# EAGLE design PacBot Official Schematic (EAGLE 9.2.0)
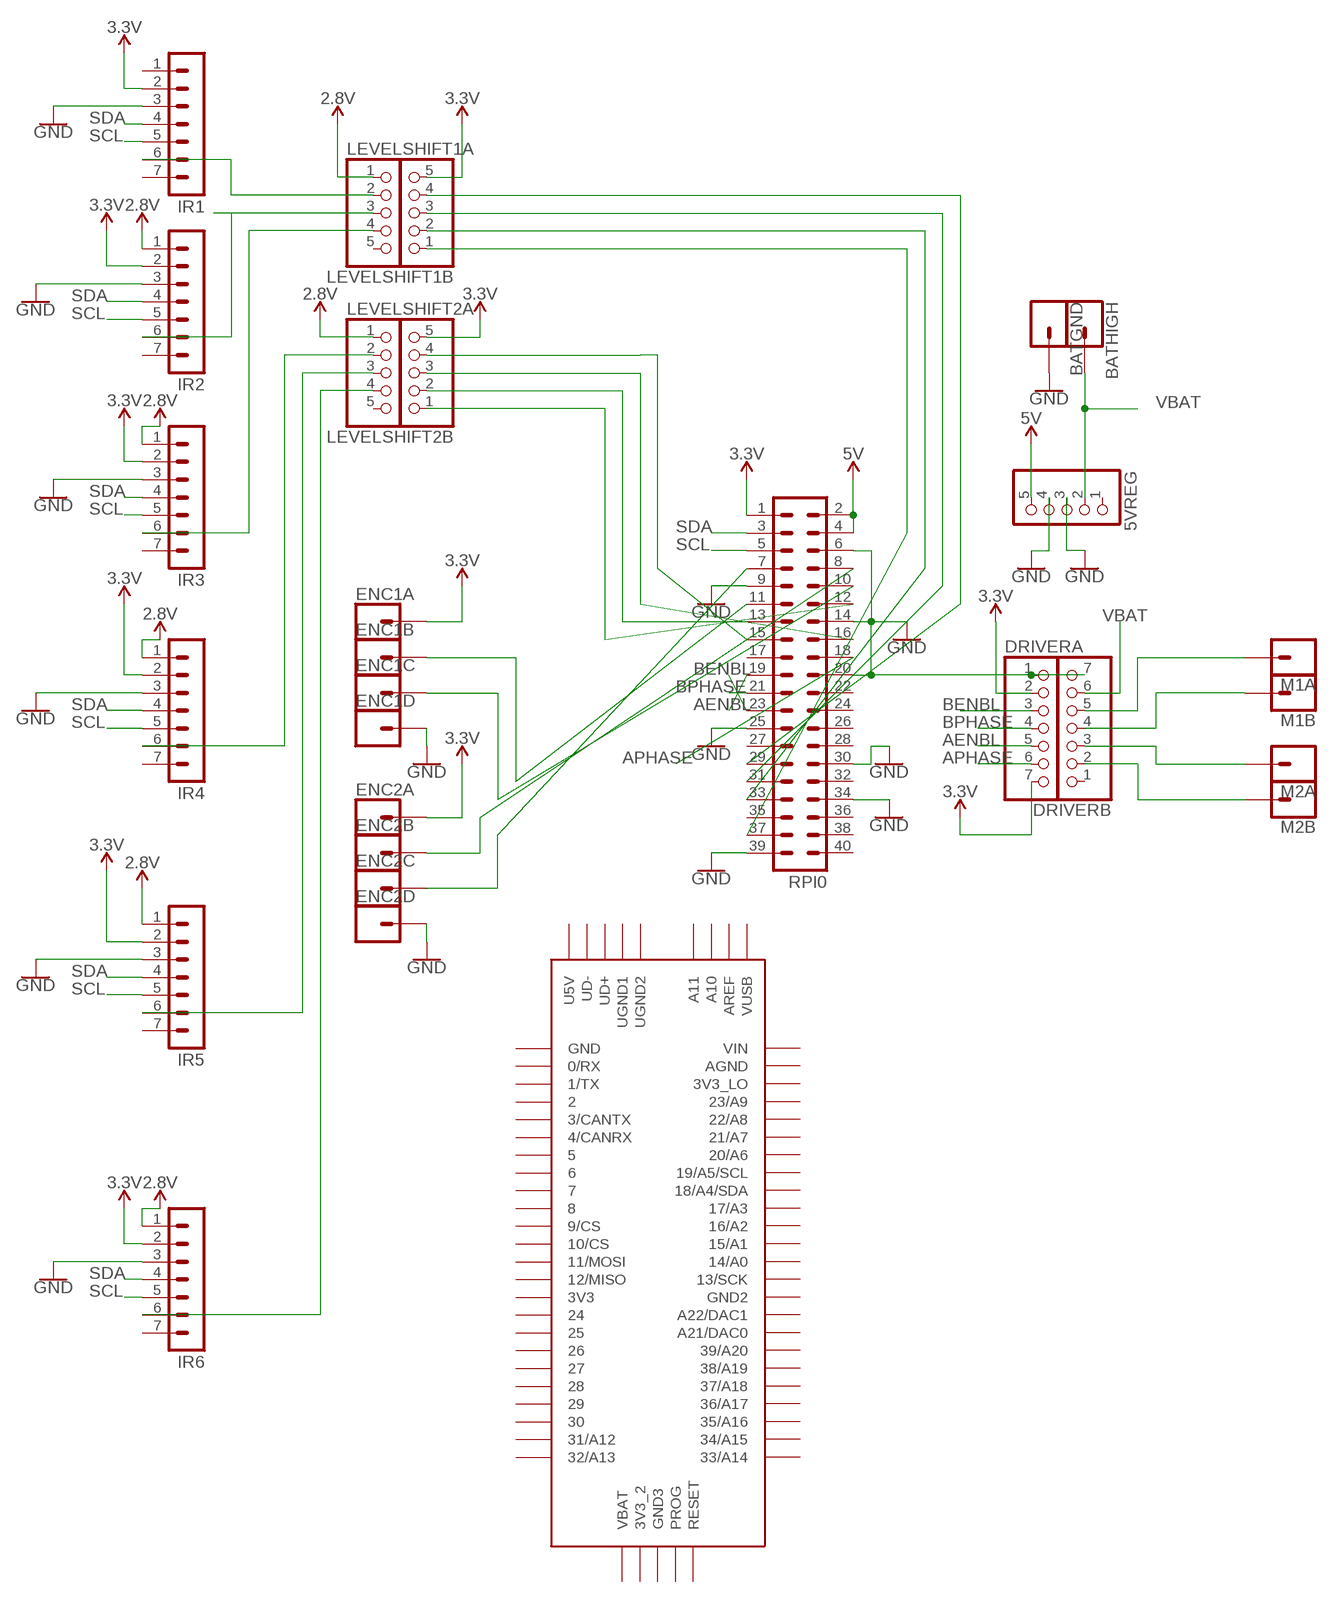
[diagram p0: schematic, sheet 1]

## Parts
5VREG  PINHD-1X5  [1X05]
BATGND  CONN_01  [1X01]
BATHIGH  CONN_01  [1X01]
DRIVERA  PINHD-1X7  [1X07]
DRIVERB  PINHD-1X7  [1X07]
ENC1A  CONN_01  [1X01]
ENC1B  CONN_01  [1X01]
ENC1C  CONN_01  [1X01]
ENC1D  CONN_01  [1X01]
ENC2A  CONN_01  [1X01]
ENC2B  CONN_01  [1X01]
ENC2C  CONN_01  [1X01]
ENC2D  CONN_01  [1X01]
IR1  MA07-1  [MA07-1]
IR2  MA07-1  [MA07-1]
IR3  MA07-1  [MA07-1]
IR4  MA07-1  [MA07-1]
IR5  MA07-1  [MA07-1]
IR6  MA07-1  [MA07-1]
LEVELSHIFT1A  PINHD-1X5  [1X05]
LEVELSHIFT1B  PINHD-1X5  [1X05]
LEVELSHIFT2A  PINHD-1X5  [1X05]
LEVELSHIFT2B  PINHD-1X5  [1X05]
M1A  CONN_01  [1X01]
M1B  CONN_01  [1X01]
M2A  CONN_01  [1X01]
M2B  CONN_01  [1X01]
RPI0  MA20-2  [MA20-2]
U$1  TEENSY_3.5/3.6  [TEENSY_3.5/3.6]

## Nets
2.8V: IR2.1 IR3.1 IR4.1 IR5.1 IR6.1 LEVELSHIFT1A.1 LEVELSHIFT2A.1
3.3V: DRIVERA.2 DRIVERA.7 ENC1A.1 ENC2A.1 IR1.2 IR2.2 IR3.2 IR4.2 IR5.2 IR6.2 LEVELSHIFT1B.5 LEVELSHIFT2B.5 RPI0.1
5V: 5VREG.5 RPI0.2 RPI0.4
AENBL: DRIVERA.5 RPI0.19
APHASE: DRIVERA.6 RPI0.18
BENBL: DRIVERA.3 RPI0.23
BPHASE: DRIVERA.4 RPI0.21
GND: 5VREG.3 5VREG.4 BATGND.1 DRIVERA.1 DRIVERB.7 ENC1D.1 ENC2D.1 IR1.3 IR2.3 IR3.3 IR4.3 IR5.3 IR6.3 RPI0.6 RPI0.9 RPI0.14 RPI0.20 RPI0.25 RPI0.30 RPI0.34 RPI0.39
N$1: ENC1B.1 RPI0.11
N$2: LEVELSHIFT1A.3
N$3: IR4.6 LEVELSHIFT2A.2
N$4: IR2.6
N$6: LEVELSHIFT2B.2 RPI0.13
N$7: LEVELSHIFT2B.1 RPI0.12
N$8: DRIVERB.5 M1A.1
N$9: DRIVERB.4 M1B.1
N$10: DRIVERB.3 M2A.1
N$11: DRIVERB.2 M2B.1
N$12: ENC1C.1 RPI0.10
N$13: ENC2B.1 RPI0.8
N$14: ENC2C.1 RPI0.7
N$15: IR5.6 LEVELSHIFT2A.3
N$16: IR6.6 LEVELSHIFT2A.4
N$17: LEVELSHIFT1B.4 RPI0.29
N$18: LEVELSHIFT1B.3 RPI0.31
N$19: LEVELSHIFT1B.2 RPI0.33
N$20: LEVELSHIFT1B.1 RPI0.37
N$21: LEVELSHIFT2B.4 RPI0.15
N$22: LEVELSHIFT2B.3 RPI0.16
N$23: IR1.6 LEVELSHIFT1A.2
N$25: IR3.6 LEVELSHIFT1A.4
SCL: IR1.5 IR2.5 IR3.5 IR4.5 IR5.5 IR6.5 RPI0.5
SDA: IR1.4 IR2.4 IR3.4 IR4.4 IR5.4 IR6.4 RPI0.3
VBAT: 5VREG.2 BATHIGH.1 DRIVERB.6
Unconnected: 5VREG.1 DRIVERB.1 IR1.1 IR1.7 IR2.7 IR3.7 IR4.7 IR5.7 IR6.7 LEVELSHIFT1A.5 LEVELSHIFT2A.5 RPI0.17 RPI0.22 RPI0.24 RPI0.26 RPI0.27 RPI0.28 RPI0.32 RPI0.35 RPI0.36 RPI0.38 RPI0.40 U$1.0/RX U$1.1/TX U$1.2 U$1.3/CANTX U$1.3V3 U$1.3V3_2 U$1.3V3_LO U$1.4/CANRX U$1.5 U$1.6 U$1.7 U$1.8 U$1.9/CS U$1.10/CS U$1.11/MOSI U$1.12/MISO U$1.13/SCK U$1.14/A0 U$1.15/A1 U$1.16/A2 U$1.17/A3 U$1.18/A4/SDA U$1.19/A5/SCL U$1.20/A6 U$1.21/A7 U$1.21/DAC0(A21/DAC0) U$1.22/A8 U$1.23/A9 U$1.24 U$1.25 U$1.26 U$1.27 U$1.28 U$1.29 U$1.30 U$1.31/A12 U$1.32/A13 U$1.33/A14 U$1.34/A15 U$1.35/A16 U$1.36/A17 U$1.37/A18 U$1.38/A19 U$1.39/A20 U$1.A10 U$1.A11 U$1.A22/DAC1 U$1.AGND U$1.AREF U$1.GND U$1.GND2 U$1.GND3 U$1.PROG U$1.RESET U$1.U5V U$1.UD+ U$1.UD- U$1.UGND1 U$1.UGND2 U$1.VBAT U$1.VIN U$1.VUSB

## Library data of the parts
5VREG LEVELSHIFT1A LEVELSHIFT1B LEVELSHIFT2A LEVELSHIFT2B = pinhead:PINHD-1X5: PIN HEADER
BATGND BATHIGH ENC1A ENC1B ENC1C ENC1D ENC2A ENC2B ENC2C ENC2D M1A M1B M2A M2B = SparkFun-Connectors:CONN_01: Single connection point. Often used as Generic Header-pin footprint for 0.1 inch spaced/style header connections On any of the 0.1 inch spaced packages, you can populate with these: Break Away Headers - Straight <https://www.sparkfun.com/products/116> (PRT-00116) Break Away Male Headers - Right Angle <https://www.sparkfun.com/products/553> (PRT-00553) Female Headers <https://www.sparkfun.com/products/115> (PRT-00115) Break Away Headers - Machine Pin <https://www.sparkfun.com/products/117> (PRT-00117) Break Away Female Headers - Swiss Machine Pin <https://www.sparkfun.com/products/743> (PRT-00743) This device is also useful as a general connection point to wire up your design to another part of your project. Our various solder wires solder well into these plated through hole pads. Hook-Up Wire - Assortment (Stranded, 22 AWG) <https://www.sparkfun.com/products/11375> (PRT-11375) Hook-Up Wire - Assortment (Solid Core, 22 AWG) <https://www.sparkfun.com/products/11367> (PRT-11367) View the entire wire category on our website here <https://www.sparkfun.com/categories/141> Special notes: SMTSO-256-ET is a "flush mount" nut for a 4-40 screw. We mostly use this on specialty testbeds; it is a nice way to connect hardware to your PCB at an adjustable hieght. Also note, the SNAP packages are for using a snappable style connector. We sell a baggie of snaps and they are also used on two LilyPad designs: Snap Assortment - 30 pack (male and female) <https://www.sparkfun.com/products/11347> (DEV-11347) LilyPad Arduino SimpleSnap <https://www.sparkfun.com/products/10941> (DEV-10941) LilyPad SimpleSnap Protoboard <https://www.sparkfun.com/products/10940> (DEV-10940)
DRIVERA DRIVERB = pinhead:PINHD-1X7: PIN HEADER
IR1-IR6 = con-lstb:MA07-1: PIN HEADER; OC_FARNELL: unknown; OC_NEWARK: unknown
RPI0 = con-lstb:MA20-2: PIN HEADER; OC_FARNELL: unknown; OC_NEWARK: unknown
U$1 = Teensy356:TEENSY_3.5/3.6

## Board
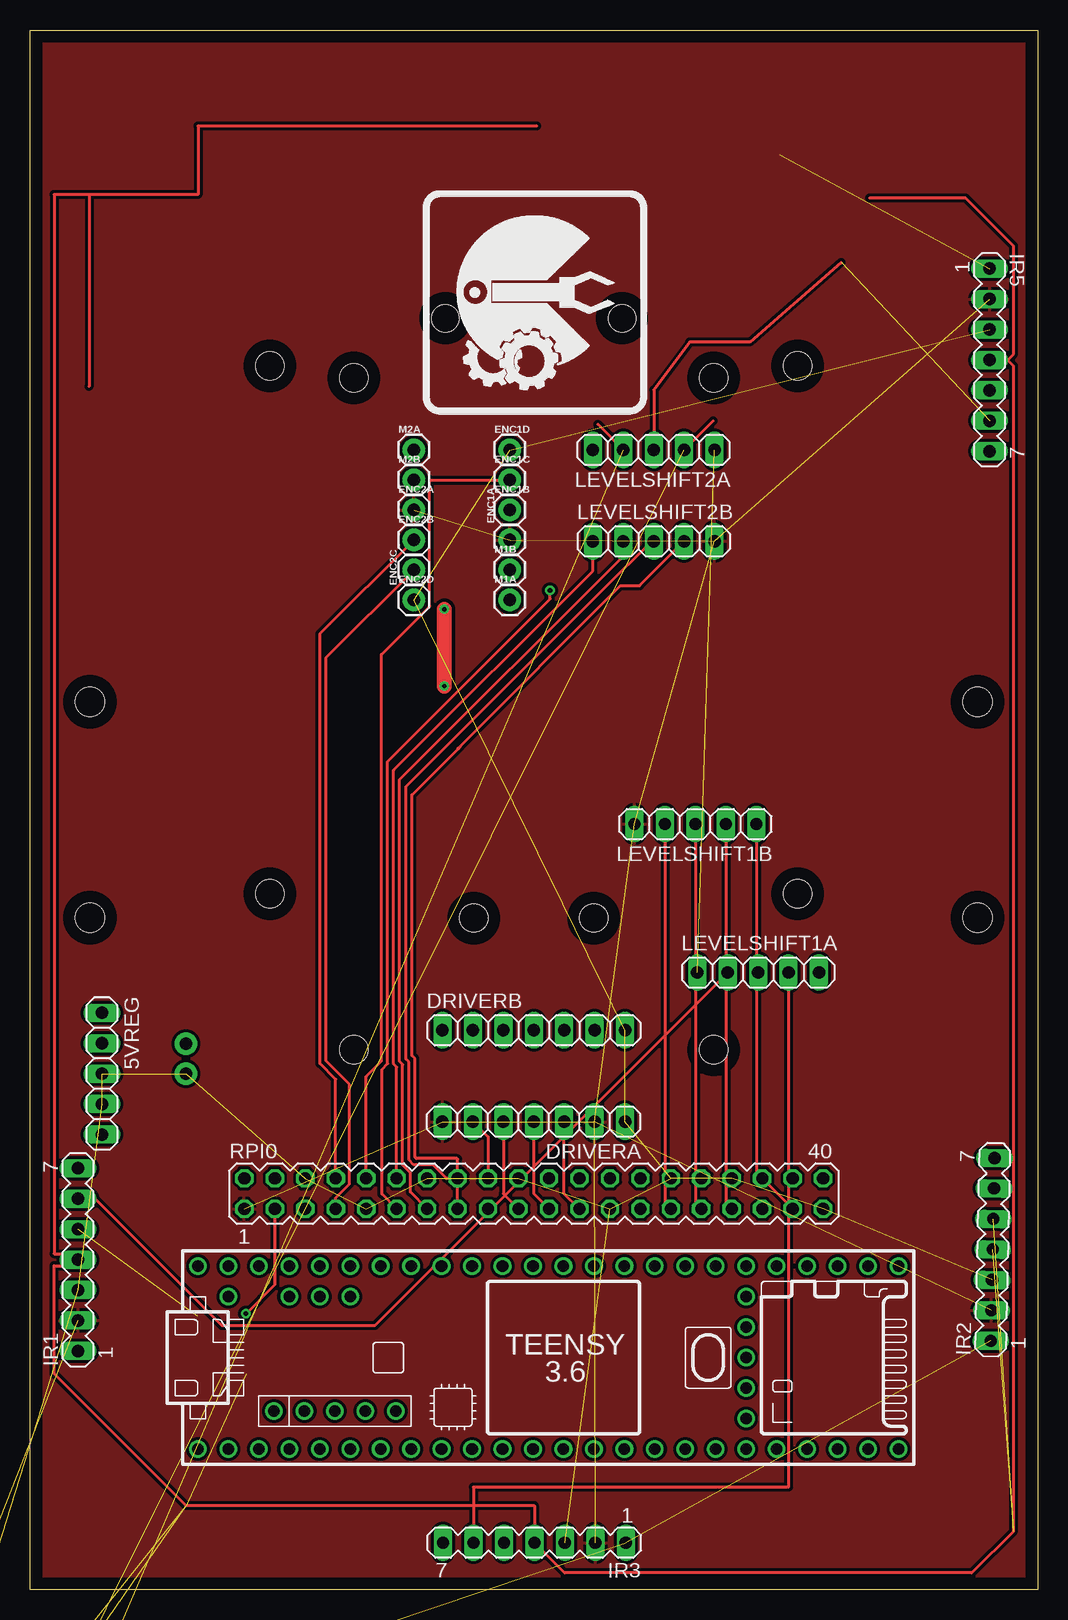
[diagram p1: board, top side]
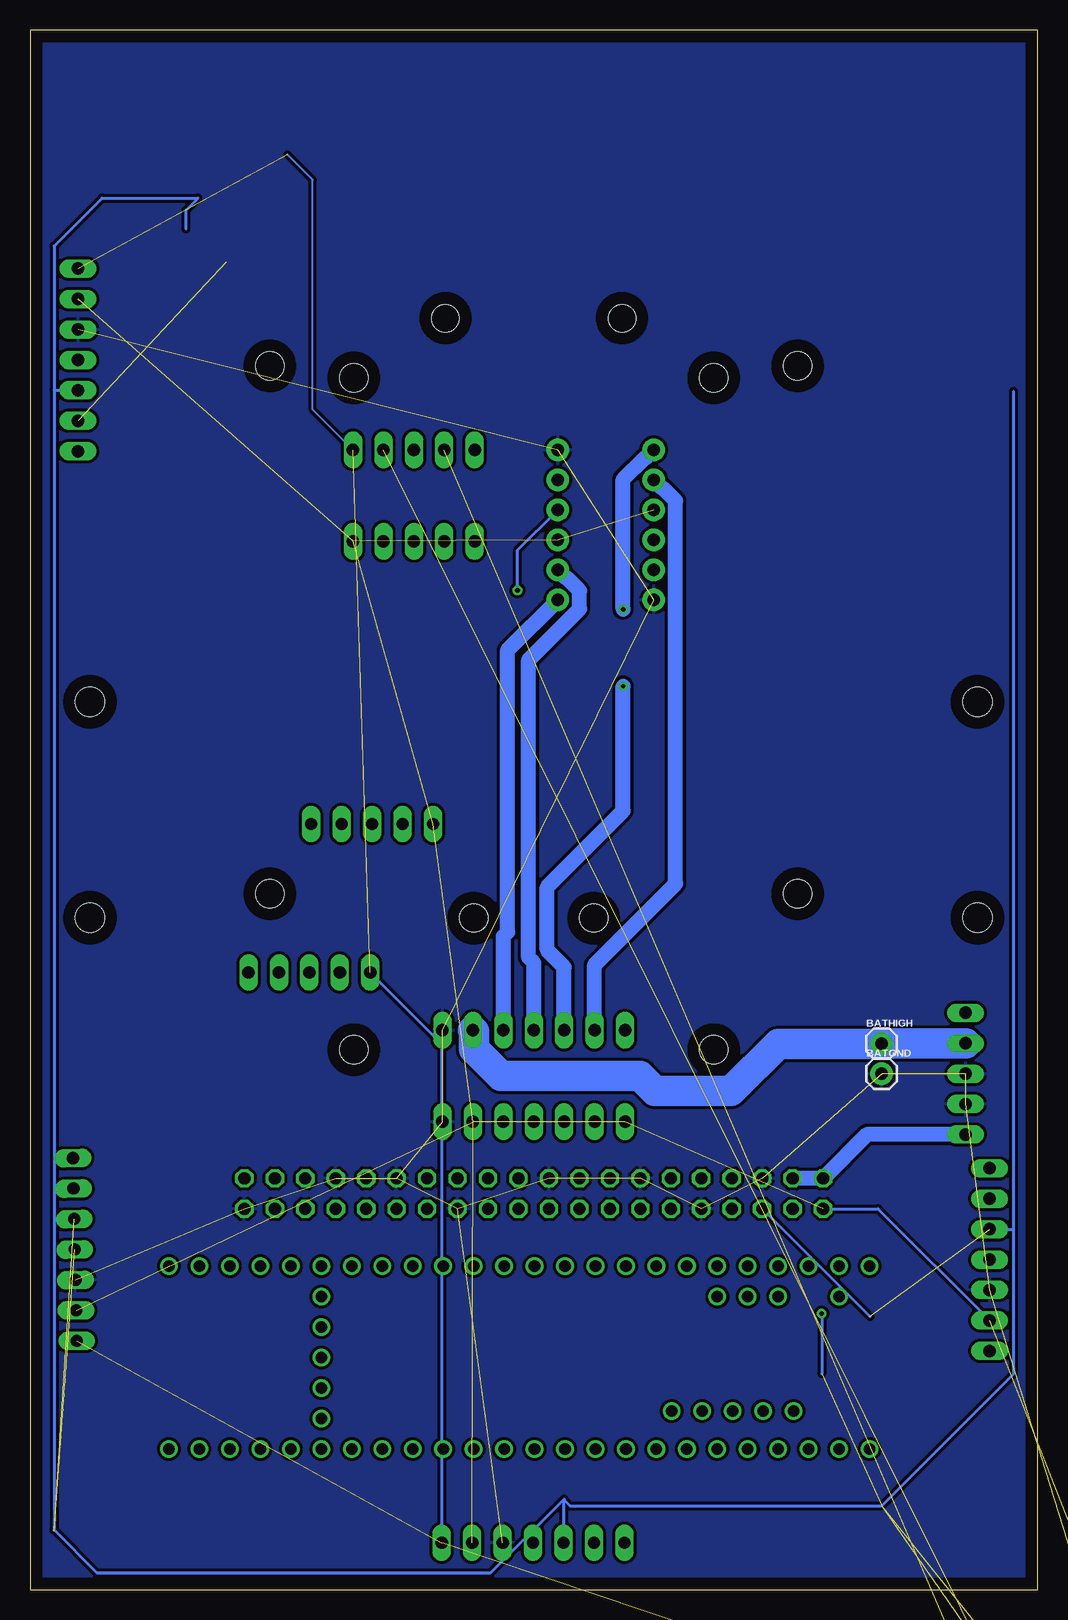
[diagram p2: board, bottom side, seen from below]

Size 84 x 130 mm. Coordinates in mm from the lower left corner, seen from the top.
Outline: 84,0 0,0 0,130 84,130 84,0
Copper layers (1*16): Top 0.035mm / dielectric 1.5mm / Bottom 0.035mm
Design rules "Pacbot v1 *": minimum track width 10mil, minimum drill 0.35mm, track to track 10mil, track to pad 10mil, pad to pad 10mil, via to via 10mil, smd to smd 10mil, copper to edge 40mil, drill to drill 10mil, minimum pad ring 10mil, minimum via ring 8mil, stop-mask expansion 4mil, vias tented up to drill 0mil, thermal gap 10mil
Holes 2.33 mm at 57,45 64,58 47,55.97 37,55.97 20,58 27,45 57,101 64,102 27,101 20,102
Holes 2.44 mm at 79,56 79,74 5,56 5,74
Holes 2.29 mm at 49.37,105.97 34.63,105.97

### Footprints (pad centres in the part's own frame; a part is rotated, then mirrored left to right if it is on the bottom)
1X05 = drill 1.016 long: 1 -5.08,0; 2 -2.54,0; 3 0,0; 4 2.54,0; 5 5.08,0
1X01 = drill 1.016 pad 1.88: 1 0,0
1X07 = drill 1.016 long: 1 -7.62,0; 2 -5.08,0; 3 -2.54,0; 4 0,0; 5 2.54,0; 6 5.08,0; 7 7.62,0
MA07-1 = drill 1.016 long: 1 -7.62,0; 2 -5.08,0; 3 -2.54,0; 4 0,0; 5 2.54,0; 6 5.08,0; 7 7.62,0
MA20-2 = drill 1.016 octagon: 1 -24.13,-1.27; 2 -24.13,1.27; 3 -21.59,-1.27; 4 -21.59,1.27; 5 -19.05,-1.27; 6 -19.05,1.27; 7 -16.51,-1.27; 8 -16.51,1.27; 9 -13.97,-1.27; 10 -13.97,1.27; 11 -11.43,-1.27; 12 -11.43,1.27; 13 -8.89,-1.27; 14 -8.89,1.27; 15 -6.35,-1.27; 16 -6.35,1.27; 17 -3.81,-1.27; 18 -3.81,1.27; 19 -1.27,-1.27; 20 -1.27,1.27; 21 1.27,-1.27; 22 1.27,1.27; 23 3.81,-1.27; 24 3.81,1.27; 25 6.35,-1.27; 26 6.35,1.27; 27 8.89,-1.27; 28 8.89,1.27; 29 11.43,-1.27; 30 11.43,1.27; 31 13.97,-1.27; 32 13.97,1.27; 33 16.51,-1.27; 34 16.51,1.27; 35 19.05,-1.27; 36 19.05,1.27; 37 21.59,-1.27; 38 21.59,1.27; 39 24.13,-1.27; 40 24.13,1.27
TEENSY_3.5/3.6 = drill 0.965: 0/RX -25.4,-7.62; 1/TX -22.86,-7.62; 2 -20.32,-7.62; 3/CANTX -17.78,-7.62; 3V3 7.62,-7.62; 3V3_2 17.78,-2.54; 3V3_LO -22.86,7.62; 4/CANRX -15.24,-7.62; 5 -12.7,-7.62; 6 -10.16,-7.62; 7 -7.62,-7.62; 8 -5.08,-7.62; 9/CS -2.54,-7.62; 10/CS 0,-7.62; 11/MOSI 2.54,-7.62; 12/MISO 5.08,-7.62; 13/SCK 5.08,7.62; 14/A0 2.54,7.62; 15/A1 0,7.62; 16/A2 -2.54,7.62; 17/A3 -5.08,7.62; 18/A4/SDA -7.62,7.62; 19/A5/SCL -10.16,7.62; 20/A6 -12.7,7.62; 21/A7 -15.24,7.62; 21/DAC0 12.7,7.62; 22/A8 -17.78,7.62; 23/A9 -20.32,7.62; 24 10.16,-7.62; 25 12.7,-7.62; 26 15.24,-7.62; 27 17.78,-7.62; 28 20.32,-7.62; 29 22.86,-7.62; 30 25.4,-7.62; 31/A12 27.94,-7.62; 32/A13 30.48,-7.62; 33/A14 30.48,7.62; 34/A15 27.94,7.62; 35/A16 25.4,7.62; 36/A17 22.86,7.62; 37/A18 20.32,7.62; 38/A19 17.78,7.62; 39/A20 15.24,7.62; A10 -17.78,5.08; A11 -15.24,5.08; A22/DAC1 10.16,7.62; AGND -25.4,7.62; AREF -20.32,5.08; GND -27.94,-7.62; GND2 7.62,7.62; GND3 17.78,0; PROG 17.78,2.54; RESET 17.78,5.08; U5V -21.59,-4.445; UD+ -16.51,-4.445; UD- -19.05,-4.445; UGND1 -13.97,-4.445; UGND2 -11.43,-4.445; VBAT 17.78,-5.08; VIN -27.94,7.62; VUSB -25.4,5.08

### Placement (x,y rotation side)
5VREG  6,43 270 top
BATGND  13,43 0 bottom
BATHIGH  13,45.5 0 bottom
DRIVERA  42,39 180 top
DRIVERB  42,46.62 0 top
ENC1A  40,87.5 0 top
ENC1B  40,90 0 top
ENC1C  40,92.5 0 top
ENC1D  40,95 0 top
ENC2A  32,90 0 top
ENC2B  32,87.5 0 top
ENC2C  32,85 90 top
ENC2D  32,82.5 0 top
IR1  4,27.5 90 top
IR2  80.26,28.35 88.8 top
IR3  42.05,3.9 180 top
IR4  -6.71,-17.63 0 top  (outside the outline)
IR5  80,102.5 270 top
IR6  -6.71,-24.54 0 top  (outside the outline)
LEVELSHIFT1A  60.71,51.43 0 top
LEVELSHIFT1B  55.48,63.8 180 top
LEVELSHIFT2A  52,95 180 top
LEVELSHIFT2B  52,87.38 0 top
M1A  40,82.5 0 top
M1B  40,85 0 top
M2A  32,95 0 top
M2B  32,92.5 0 top
RPI0  42,33 0 top
U$1  41.94,19.33 0 top

### Tracks (layer width: path | path; a pad name or v marks a point on that pad's centre or on a via)
2.8V  (5 unrouted)
  Bottom 0.152: LEVELSHIFT2A.1 60.43,98.35 60.43,117.5 62.54,119.61
  Bottom 0.254: LEVELSHIFT1A.1 49.67,45.48 IR3.1
3.3V  (11 unrouted)
  Bottom 0.254: RPI0.1 13.31,31.73 IR1.2
  pour Top: -11,135 92,135 92,-10 -11,-10
5V
  Bottom 1.27: 5VREG.5 14.22,37.92 RPI0.2 RPI0.4
AENBL
  Top 0.254: DRIVERA.5 39.46,33 RPI0.19
APHASE
  Top 0.254: DRIVERA.6 38.19,37.73 RPI0.18
BENBL
  Top 0.254: RPI0.23 44.54,33 DRIVERA.3
BPHASE
  Top 0.254: RPI0.21 42,33 DRIVERA.4
GND  (20 unrouted)
  pour Bottom: -16,140 -16,-14 98,-14 98,140
N$1  (via drill 0.4)
  Top 0.254: RPI0.11 29.34,32.96 29.34,43.35 29.82,43.83 29.82,69.03 43.36,82.58 v43.36,83.29
  Bottom 0.254: v43.36,83.29 43.36,86.64 ENC1B.1
N$3  (1 unrouted)
  Top 0.254: LEVELSHIFT2A.2 56.96,97.42
N$6
  Top 0.254: RPI0.13 31.71,33.13 31.71,34.74 31.08,35.38 31.08,43.76 30.83,44 30.83,67.53 49.46,86.16 LEVELSHIFT2B.2
N$7
  Top 0.254: RPI0.12 30.57,43.55 30.32,43.79 30.32,68.3 46.92,84.9 LEVELSHIFT2B.1
N$8
  Bottom 1.27: DRIVERB.5 44.54,54.45 44.18,54.8 44.18,78.32 M1A.1
N$9
  Bottom 1.27: DRIVERB.4 42,52.27 42.42,52.68 42.42,77.5 38.17,81.74 38.17,83.26 39.24,84.33 39.33,84.33 M1B.1
N$10  (via drill 0.35)
  Top 1.27: v34.54,75.31 v34.54,81.71
  Bottom 1.27: DRIVERB.3 39.46,51.88 40.89,53.31 40.89,58.55 34.54,64.9 v34.54,75.31 | M2A.1 32.67,94.33 32.76,94.33 34.54,92.54 v34.54,81.71
N$11
  Bottom 1.27: DRIVERB.2 36.92,52.07 30.17,58.82 30.17,90.76 31.24,91.83 31.33,91.83 M2B.1
N$12
  Top 0.254: RPI0.10 28.03,42.77 29.31,44.04 29.31,77.94 | 29.31,77.94 29.32,77.94 | 29.31,77.94 33.32,81.95 | 33.3,81.94 33.32,81.95 | 33.32,81.95 33.32,92.43 33.39,92.5 ENC1C.1
N$13
  Top 0.254: RPI0.8 25.49,42.53 24.18,43.83 24.18,79.68 ENC2B.1
N$14
  Top 0.254: RPI0.7 25.49,32.65 26.63,33.8 26.63,42.1 24.69,44.04 24.69,77.69 ENC2C.1
N$15  (1 unrouted)
  Top 0.254: 67.64,110.64 60,104 55,104 52,100 LEVELSHIFT2A.3
N$16  (1 unrouted)
  Top 0.254: LEVELSHIFT2A.4 47.33,97.13
N$17
  Top 0.254: LEVELSHIFT1B.4 52.94,32.22 RPI0.29
N$18
  Top 0.254: LEVELSHIFT1B.3 55.48,32.22 RPI0.31
N$19
  Top 0.254: LEVELSHIFT1B.2 58.02,32.22 RPI0.33
N$20
  Top 0.254: LEVELSHIFT1B.1 60.56,34.76 RPI0.37
N$21
  Top 0.254: RPI0.15 35.65,35.89 35.62,35.92 32.22,35.92 32.09,36.04 32.09,44.26 31.85,44.5 31.85,66.24 35.67,70.07 | 35.67,70.07 35.87,70.26 | 35.67,70.07 35.67,70.12 49.23,83.67 50.83,83.67 LEVELSHIFT2B.4
N$22
  Top 0.254: RPI0.16 34.73,34.27 33.58,35.41 31.99,35.41 31.59,35.81 31.59,43.97 31.34,44.21 31.34,66.93 49.89,85.47 49.93,85.47 51.84,87.38 LEVELSHIFT2B.3
N$23
  Top 0.254: LEVELSHIFT1A.2 28.73,22 16,22 5.42,32.58 IR1.6
N$25
  Top 0.254: LEVELSHIFT1A.4 63.25,8.54 36.97,8.54 IR3.6
SCL  (4 unrouted)
  Bottom 0.254: 39.51,7.49 IR3.5 | 2,30 2,18 13,7 39,7 39.46,7.46 39.46,7.54 39.51,7.49 | 2,30 3.96,30 IR1.5 | 2,30 2,99.88 | 71,113.41 71,115 70,116 78,116 82,112 82,100 | 82,100 81.96,99.96 IR5.5 | 82,100 82,4.97 78.42,1.39 45.61,1.39 39.51,7.49 | RPI0.5 13.98,22.76
SDA  (via drill 0.4)  (4 unrouted)
  Top 0.254: 81.5,102.5 82,102 82,4.87 78.52,1.39 44.57,1.39 IR3.4 42.05,7 13,7 2,18 2,27 3.5,27 IR1.4 3.5,28 2,28 2,116.27 4.93,116.27 | IR5.4 81.5,102.5 | 81.5,102.5 82,103 82,112 78,116 70,116 | 42.25,122 14,122 14,116.27 4.93,116.27 | 4.93,116.27 4.93,100.27 | RPI0.3 20.41,25.41 v18,23
  Bottom 0.254: v18,23 18,18
VBAT
  Bottom 2.54: 5VREG.2 12.96,45.54 BATHIGH.1 21.62,45.5 25.57,41.55 28.43,41.55 28.44,41.55 31.88,41.55 33.15,42.82 44.74,42.82 46.97,45.05 46.97,46.51 DRIVERB.6

### Text on the board
tPlace: C:/Users/charl/Downloads/pacbot2v2blk.bmp